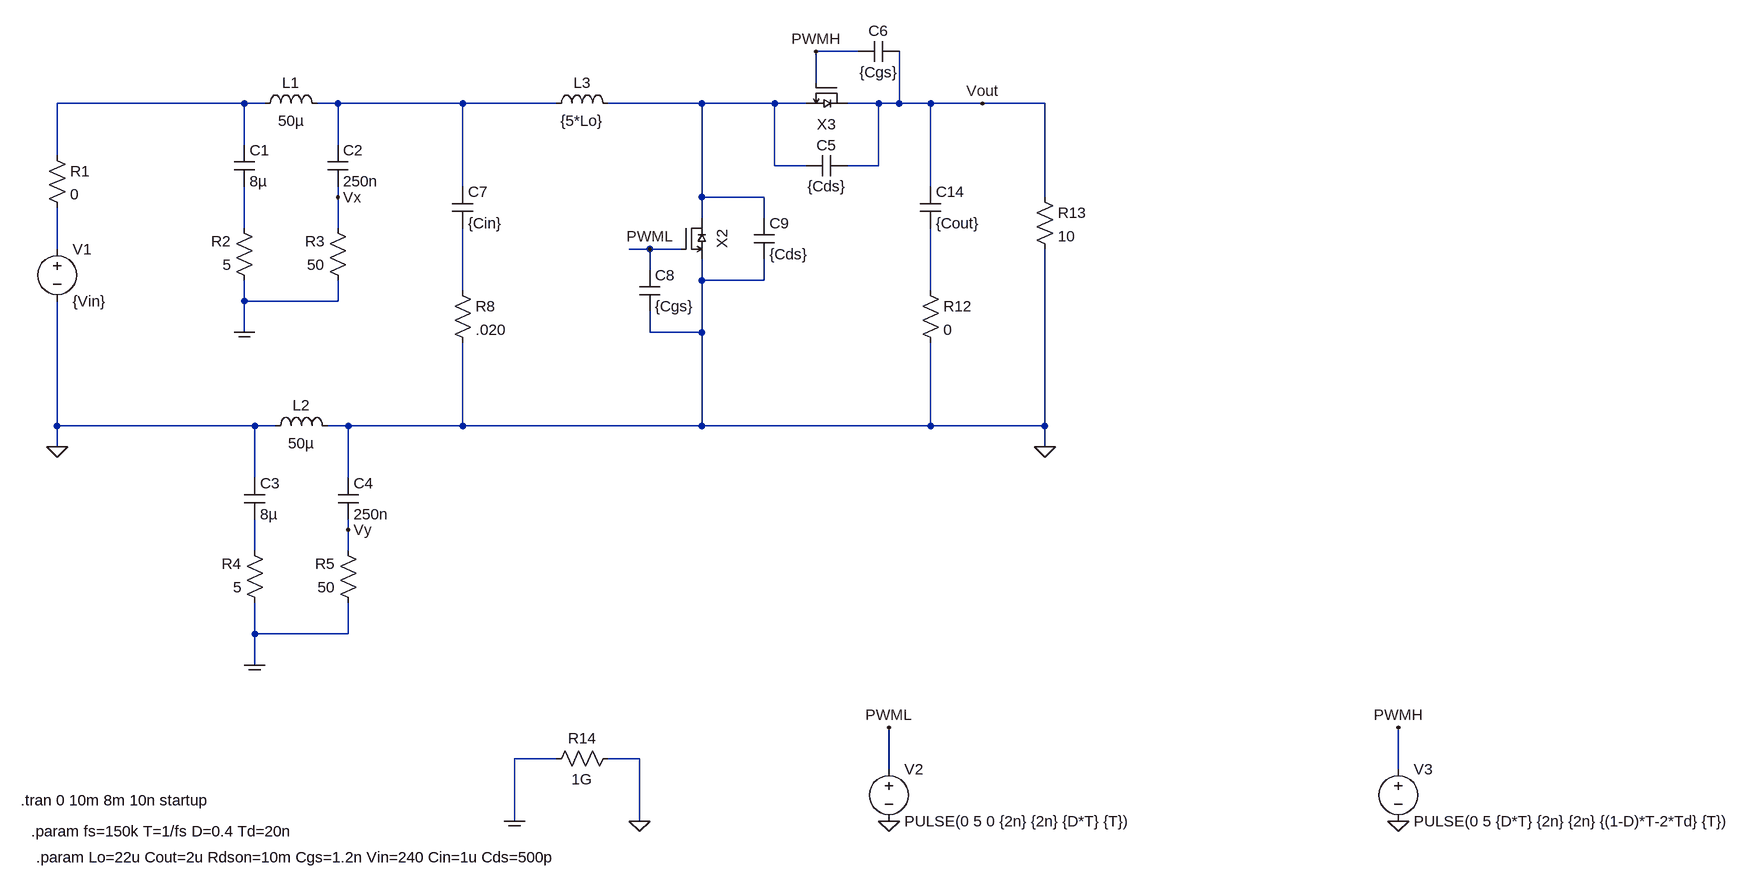
[diagram p0: schematic Boost_EMI.asc]
Boost_EMI.asc, the LTspice schematic file:
Version 4
SHEET 1 2212 1204
WIRE 352 -64 288 -64
WIRE 288 -16 288 -64
WIRE -592 16 -880 16
WIRE -560 16 -592 16
WIRE -448 16 -480 16
WIRE -256 16 -448 16
WIRE -112 16 -256 16
WIRE 112 16 -32 16
WIRE 224 16 112 16
WIRE 272 16 224 16
WIRE 384 16 336 16
WIRE 416 16 416 -64
WIRE 416 16 384 16
WIRE 464 16 416 16
WIRE 544 16 464 16
WIRE 640 16 544 16
WIRE -592 80 -592 16
WIRE -448 80 -448 16
WIRE -880 96 -880 16
WIRE 224 112 224 16
WIRE 272 112 224 112
WIRE 384 112 384 16
WIRE 384 112 336 112
WIRE -256 144 -256 16
WIRE 464 144 464 16
WIRE -448 160 -448 144
WIRE 112 160 112 16
WIRE 208 160 112 160
WIRE 640 160 640 16
WIRE 112 192 112 160
WIRE 208 192 208 160
WIRE -592 208 -592 144
WIRE -448 208 -448 160
WIRE -880 240 -880 176
WIRE 32 240 0 240
WIRE 80 240 32 240
WIRE 32 272 32 240
WIRE 112 288 112 256
WIRE 208 288 208 256
WIRE 208 288 112 288
WIRE -256 304 -256 208
WIRE 464 304 464 208
WIRE -592 320 -592 288
WIRE -448 320 -448 288
WIRE -448 320 -592 320
WIRE -592 368 -592 320
WIRE 32 368 32 336
WIRE 112 368 112 288
WIRE 112 368 32 368
WIRE -880 512 -880 320
WIRE -576 512 -880 512
WIRE -544 512 -576 512
WIRE -432 512 -464 512
WIRE -256 512 -256 384
WIRE -256 512 -432 512
WIRE 112 512 112 368
WIRE 112 512 -256 512
WIRE 464 512 464 384
WIRE 464 512 112 512
WIRE 640 512 640 240
WIRE 640 512 464 512
WIRE -880 544 -880 512
WIRE 640 544 640 512
WIRE -576 592 -576 512
WIRE -432 592 -432 512
WIRE -432 672 -432 656
WIRE -576 704 -576 656
WIRE -432 704 -432 672
WIRE -576 832 -576 784
WIRE -432 832 -432 784
WIRE -432 832 -576 832
WIRE -576 880 -576 832
WIRE -112 1024 -176 1024
WIRE 16 1024 -32 1024
WIRE 400 1040 400 976
WIRE 1184 1040 1184 976
WIRE -176 1120 -176 1024
WIRE 16 1120 16 1024
FLAG -592 368 COM
FLAG -576 880 COM
FLAG -448 160 Vx
FLAG -432 672 Vy
FLAG -880 544 0
FLAG -176 1120 COM
FLAG 16 1120 0
FLAG 400 1120 0
FLAG 640 544 0
FLAG 400 976 PWML
FLAG 32 240 PWML
FLAG 288 -64 PWMH
FLAG 1184 1120 0
FLAG 1184 976 PWMH
FLAG 544 16 Vout
DATAFLAG 480 16 ""
DATAFLAG -880 16 ""
SYMBOL voltage -880 224 R0
WINDOW 123 0 0 Left 0
WINDOW 39 0 0 Left 0
SYMATTR InstName V1
SYMATTR Value {Vin}
SYMBOL res -896 80 R0
SYMATTR InstName R1
SYMATTR Value 0
SYMBOL res -576 304 R180
WINDOW 0 36 76 Left 2
WINDOW 3 36 40 Left 2
SYMATTR InstName R2
SYMATTR Value 5
SYMBOL res -432 304 R180
WINDOW 0 36 76 Left 2
WINDOW 3 36 40 Left 2
SYMATTR InstName R3
SYMATTR Value 50
SYMBOL res -560 800 R180
WINDOW 0 36 76 Left 2
WINDOW 3 36 40 Left 2
SYMATTR InstName R4
SYMATTR Value 5
SYMBOL res -416 800 R180
WINDOW 0 36 76 Left 2
WINDOW 3 36 40 Left 2
SYMATTR InstName R5
SYMATTR Value 50
SYMBOL ind -576 32 R270
WINDOW 0 32 56 VTop 2
WINDOW 3 5 56 VBottom 2
SYMATTR InstName L1
SYMATTR Value 50µ
SYMBOL ind -560 528 R270
WINDOW 0 32 56 VTop 2
WINDOW 3 5 56 VBottom 2
SYMATTR InstName L2
SYMATTR Value 50µ
SYMBOL cap -608 80 R0
SYMATTR InstName C1
SYMATTR Value 8µ
SYMBOL cap -464 80 R0
SYMATTR InstName C2
SYMATTR Value 250n
SYMBOL cap -592 592 R0
SYMATTR InstName C3
SYMATTR Value 8µ
SYMBOL cap -448 592 R0
SYMATTR InstName C4
SYMATTR Value 250n
SYMBOL cap -272 144 R0
SYMATTR InstName C7
SYMATTR Value {Cin}
SYMBOL res -272 288 R0
SYMATTR InstName R8
SYMATTR Value .020
SYMBOL cap 448 144 R0
SYMATTR InstName C14
SYMATTR Value {Cout}
SYMBOL res 448 288 R0
SYMATTR InstName R12
SYMATTR Value 0
SYMBOL res 624 144 R0
SYMATTR InstName R13
SYMATTR Value 10
SYMBOL voltage 400 1024 R0
WINDOW 123 0 0 Left 0
WINDOW 39 0 0 Left 0
SYMATTR InstName V2
SYMATTR Value PULSE(0 5 0 {2n} {2n} {D*T} {T})
SYMBOL res -16 1008 R90
WINDOW 0 0 56 VBottom 2
WINDOW 3 32 56 VTop 2
SYMATTR InstName R14
SYMATTR Value 1G
SYMBOL ind -128 32 R270
WINDOW 0 32 56 VTop 2
WINDOW 3 5 56 VBottom 2
SYMATTR InstName L3
SYMATTR Value {5*Lo}
SYMBOL IdealSW 96 224 R90
SYMATTR InstName X2
SYMBOL IdealSW 304 0 R180
SYMATTR InstName X3
SYMBOL voltage 1184 1024 R0
WINDOW 123 0 0 Left 0
WINDOW 39 0 0 Left 0
SYMATTR InstName V3
SYMATTR Value PULSE(0 5 {D*T} {2n} {2n} {(1-D)*T-2*Td} {T})
SYMBOL cap 272 128 R270
WINDOW 0 32 32 VTop 2
WINDOW 3 0 32 VBottom 2
SYMATTR InstName C5
SYMATTR Value {Cds}
SYMBOL cap 352 -48 R270
WINDOW 0 32 32 VTop 2
WINDOW 3 0 32 VBottom 2
SYMATTR InstName C6
SYMATTR Value {Cgs}
SYMBOL cap 16 272 R0
SYMATTR InstName C8
SYMATTR Value {Cgs}
SYMBOL cap 192 192 R0
SYMATTR InstName C9
SYMATTR Value {Cds}
TEXT -936 1088 Left 2 !.tran 0 10m 8m 10n startup
TEXT -920 1136 Left 2 !.param fs=150k T=1/fs D=0.4 Td=20n
TEXT -912 1176 Left 2 !.param Lo=22u Cout=2u Rdson=10m Cgs=1.2n Vin=240 Cin=1u Cds=500p

The netlist it stands for:
* Boost_EMI.asc
V1 N005 0 {Vin}
R1 N001 N005 0
R2 COM N004 5
R3 COM Vx 50
R4 COM N008 5
R5 COM Vy 50
L1 N001 N002 50µ
L2 0 0 50µ
C1 N001 N004 8µ
C2 N002 Vx 250n
C3 0 N008 8µ
C4 0 Vy 250n
C7 N002 N006 {Cin}
R8 N006 0 .020
C14 Vout N007 {Cout}
R12 N007 0 0
R13 Vout 0 10
V2 PWML 0 PULSE(0 5 0 {2n} {2n} {D*T} {T})
R14 0 COM 1G
L3 N002 N003 {5*Lo}
XX2 N003 PWML 0 IdealSW  ; pins D G S
XX3 Vout PWMH N003 IdealSW  ; pins D G S
V3 PWMH 0 PULSE(0 5 {D*T} {2n} {2n} {(1-D)*T-2*Td} {T})
C5 N003 Vout {Cds}
C6 PWMH Vout {Cgs}
C8 PWML 0 {Cgs}
C9 N003 0 {Cds}
.tran 0 10m 8m 10n startup
.param fs=150k T=1/fs D=0.4 Td=20n
.param Lo=22u Cout=2u Rdson=10m Cgs=1.2n Vin=240 Cin=1u Cds=500p
.backanno
.end